# EAGLE design SAML21 Breakout (EAGLE 7.7.0)
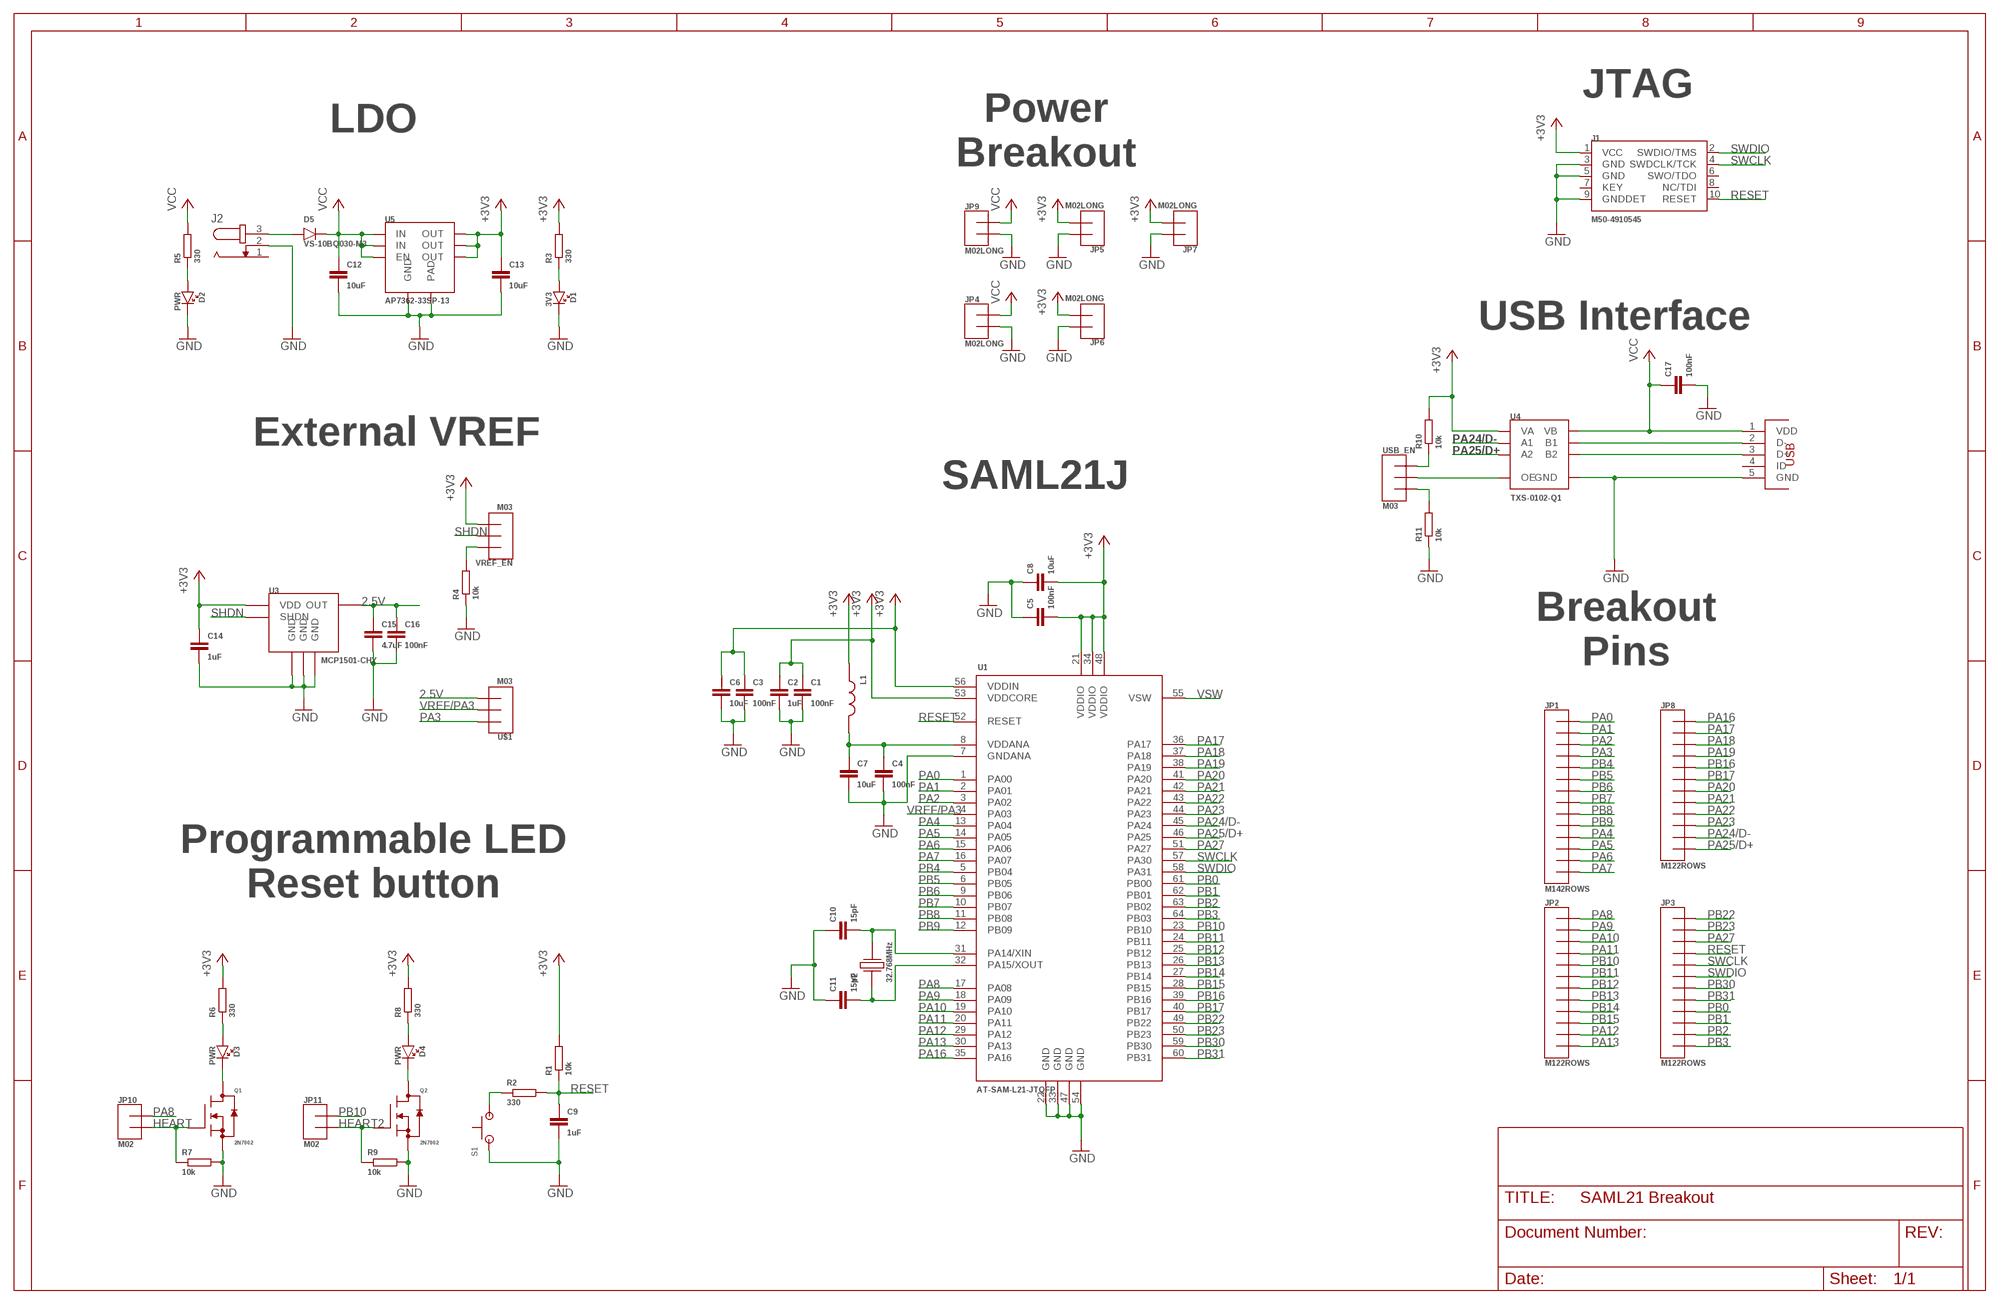
[diagram p0: schematic, sheet 1]

## Parts
C1  100nF  CAP0603  [CAP-0603]
C2  1uF  CAP0603  [CAP-0603]
C3  100nF  CAP0603  [CAP-0603]
C4  100nF  CAP0603  [CAP-0603]
C5  100nF  CAP0603  [CAP-0603]
C6  10uF  CAP0603  [CAP-0603]
C7  10uF  CAP0603  [CAP-0603]
C8  10uF  CAP0603  [CAP-0603]
C9  1uF  CAP0603  [CAP-0603]
C10  15pF  CAP0603  [CAP-0603]
C11  15pF  CAP0603  [CAP-0603]
C12  10uF  CAP0603  [CAP-0603]
C13  10uF  CAP0603  [CAP-0603]
C14  1uF  CAP0603  [CAP-0603]
C15  4.7uF  CAP0603  [CAP-0603]
C16  100nF  CAP0603  [CAP-0603]
C17  100nF  CAP0603  [CAP-0603]
D1  3V3  LED1206  [LED-1206]
D2  PWR  LED1206  [LED-1206]
D3  PWR  LED1206  [LED-1206]
D4  PWR  LED1206  [LED-1206]
D5  VS-10BQ030-M3  [DO-214AA]
J1  M50-4910545  [M50-4910545]
J2  JACK-PLUG0  [SPC4077]
JP1  M142ROWS  [2X07]
JP2  M122ROWS  [2X06]
JP3  M122ROWS  [2X06]
JP4  M02LONG  [1X02-LONG]
JP5  M02LONG  [1X02-LONG]
JP6  M02LONG  [1X02-LONG]
JP7  M02LONG  [1X02-LONG]
JP8  M122ROWS  [2X06]
JP9  M02LONG  [1X02-LONG]
JP10  M02  [1X02]
JP11  M02  [1X02]
L1  INDUCTOR0603  [IND-0603]
Q1  2N7002  [SOT-23-3]
Q2  2N7002  [SOT-23-3]
R1  10k  RESISTOR0805  [RES-0805]
R2  330  RESISTOR0805  [RES-0805]
R3  330  RESISTOR0805  [RES-0805]
R4  10k  RESISTOR0805  [RES-0805]
R5  330  RESISTOR0805  [RES-0805]
R6  330  RESISTOR0805  [RES-0805]
R7  10k  RESISTOR0805  [RES-0805]
R8  330  RESISTOR0805  [RES-0805]
R9  10k  RESISTOR0805  [RES-0805]
R10  10k  RESISTOR0805  [RES-0805]
R11  10k  RESISTOR0805  [RES-0805]
S1  SKHMQME010  [SKHMQME010]
U1  AT-SAM-L21-JTQFP  [TQFP-64]
U3  MCP1501-CHY  [SOT-23-6]
U4  TXS-0102-Q1  [VSSOP-8]
U5  AP7362-33SP-13  [SO-8EP]
U$1  M03  [1X03]
U$6  MOLEX_USBMICRO  [MOLEX_47346-001]
USB_EN  M03  [1X03]
VREF_EN  M03  [1X03]
Y2  32.768MHz  LFXTAL054236-R  [CFPX-217]

## Nets
2.5V: C15.1 C16.1 U3.1(OUT) U$1.3
+3V3: C1.1 C2.1 C3.1 C5.2 C6.1 C8.2 C13.1 C14.1 J1.1(VCC) JP5.2 JP6.2 JP7.2 L1.1 R1.2 R3.2 R6.2 R8.2 R10.2 U1.21(VDDIO) U1.34(VDDIO) U1.48(VDDIO) U1.53(VDDCORE) U1.56(VDDIN) U3.6(VDD) U4.3(VA) U5.5(OUT) U5.6(OUT) U5.7(OUT) VREF_EN.3
GND: C1.2 C2.2 C3.2 C4.2 C5.1 C6.2 C7.2 C8.1 C9.2 C10.1 C11.1 C12.2 C13.2 C14.2 C15.2 C16.2 C17.2 D1.C D2.C J1.3(GND) J1.5(GND) J1.9(GNDDET) J2.2 JP4.2 JP5.1 JP6.1 JP7.1 JP9.2 Q1.S Q2.S R4.1 R7.2 R9.2 R11.1 S1.1 U1.7(GNDANA) U1.22(GND) U1.33(GND) U1.47(GND) U1.54(GND) U3.2(GND) U3.3(GND) U3.5(GND) U4.2(GND) U5.1(GND) U5.PAD U$6.5(GND)
HEART: JP10.2 Q1.D R7.1
HEART2: JP11.2 Q2.D R9.1
N$1: R2.1 S1.3
N$2: D1.A R3.1
N$3: C4.1 C7.1 L1.2 U1.8(VDDANA)
N$4: C10.2 U1.31(PA14/XIN) Y2.2
N$5: C11.2 U1.32(PA15/XOUT) Y2.1
N$6: D2.A R5.1
N$7: R4.2 VREF_EN.1
N$8: D3.A R6.1
N$9: D3.C Q1.G
N$10: D4.A R8.1
N$11: D4.C Q2.G
N$12: D5.A J2.3
N$13: R10.1 USB_EN.1
N$14: U4.8(B1) U$6.2(D-)
N$15: U4.1(B2) U$6.3(D+)
N$17: R11.2 USB_EN.3
N$19: U4.6(OE) USB_EN.2
PA0: JP1.1 U1.1(PA00)
PA1: JP1.2 U1.2(PA01)
PA2: JP1.3 U1.3(PA02)
PA3: JP1.4 U$1.1
PA4: JP1.11 U1.13(PA04)
PA5: JP1.12 U1.14(PA05)
PA6: JP1.13 U1.15(PA06)
PA7: JP1.14 U1.16(PA07)
PA8: JP2.1 JP10.1 U1.17(PA08)
PA9: JP2.2 U1.18(PA09)
PA10: JP2.3 U1.19(PA10)
PA11: JP2.4 U1.20(PA11)
PA12: JP2.11 U1.29(PA12)
PA13: JP2.12 U1.30(PA13)
PA16: JP8.1 U1.35(PA16)
PA17: JP8.2 U1.36(PA17)
PA18: JP8.3 U1.37(PA18)
PA19: JP8.4 U1.38(PA19)
PA20: JP8.7 U1.41(PA20)
PA21: JP8.8 U1.42(PA21)
PA22: JP8.9 U1.43(PA22)
PA23: JP8.10 U1.44(PA23)
PA24/D-: JP8.11 U1.45(PA24) U4.5(A1)
PA25/D+: JP8.12 U1.46(PA25) U4.4(A2)
PA27: JP3.3 U1.51(PA27)
PB0: JP3.9 U1.61(PB00)
PB1: JP3.10 U1.62(PB01)
PB2: JP3.11 U1.63(PB02)
PB3: JP3.12 U1.64(PB03)
PB4: JP1.5 U1.5(PB04)
PB5: JP1.6 U1.6(PB05)
PB6: JP1.7 U1.9(PB06)
PB7: JP1.8 U1.10(PB07)
PB8: JP1.9 U1.11(PB08)
PB9: JP1.10 U1.12(PB09)
PB10: JP2.5 JP11.1 U1.23(PB10)
PB11: JP2.6 U1.24(PB11)
PB12: JP2.7 U1.25(PB12)
PB13: JP2.8 U1.26(PB13)
PB14: JP2.9 U1.27(PB14)
PB15: JP2.10 U1.28(PB15)
PB16: JP8.5 U1.39(PB16)
PB17: JP8.6 U1.40(PB17)
PB22: JP3.1 U1.49(PB22)
PB23: JP3.2 U1.50(PB23)
PB30: JP3.7 U1.59(PB30)
PB31: JP3.8 U1.60(PB31)
RESET: C9.1 J1.10(RESET) JP3.4 R1.1 R2.2 U1.52(RESET)
SHDN: U3.4(SHDN) VREF_EN.2
SWCLK: J1.4(SWDCLK/TCK) JP3.5 U1.57(PA30)
SWDIO: J1.2(SWDIO/TMS) JP3.6 U1.58(PA31)
VCC: C12.1 C17.1 D5.C JP4.1 JP9.1 R5.2 U4.7(VB) U5.2(EN) U5.3(IN) U5.4(IN) U$6.1(VDD)
VREF/PA3: U1.4(PA03) U$1.2
VSW: U1.55(VSW)
Unconnected: J1.6(SWO/TDO) J1.7(KEY) J1.8(NC/TDI) J2.1 S1.5 U5.8(NC) U$6.4(ID)

## Notes on the sheet
- JTAG
- LDO
- Power
  Breakout
- USB Interface
- External VREF
- SAML21J
- Breakout
  Pins
- Programmable LED
  Reset button

## Library data of the parts
C1-C17 = dr-library:CAP: Multilayer Ceramic Capacitor
D1-D4 = dr-library:LED
D5 = dr-library:VS-10BQ030-M3: Vishay Semiconductors High Performance Schottky Rectifier 1.0A Mfg. No. VS-10BQ030-M3/5BT http://www.mouser.com/ds/2/427/vs-10bq030-m3-552919.pdf
J1 = dr-library:M50-4910545: Harwin 10-pin Connector M50 Series 1.27mm pitch
J2 = EmbeddedAdventures 3:JACK-PLUG: DC POWER JACK Power Jack, DC, Right Angle, Through Hole, Rated 5A at 16VDC, PC Terminals Distributor: Farnell (www.Farnell.de) Drawing: 84N1161.pdf / 84N1162.pdf Manufacturer: SPC Technology (www.spctechnology.com) Type: SPC4077 / SPC 4078
JP1 = dr-library:M14
JP2 JP3 JP8 = dr-library:M12
JP4-JP7 JP9-JP11 = dr-library:M02
L1 = dr-library:INDUCTOR
Q1 Q2 = dr-library:2N7002: Fairchild ON Semiconductor n-Type Field Effect Transistor Mfg. No. 2N7002 Mouser No. 512-2N7002 http://www.mouser.com/ds/2/149/2N7002-1006482.pdf
R1-R11 = dr-library:RESISTOR
S1 = dr-library:SKHMQME010: ALPS Tactile Switch 50mA at 12V Mouser Product # 688-SKHMQME010
U1 = dr-library:AT-SAM-L21-J: Atmel/Microchip SAML21 Series, 64-pin 32-bit ARM Cortex M0+
U3 = dr-library:MCP1501: High Precision Buffered Voltage Reference Mfg. No. MCP1501T-25E/CHY Series Reference
U4 = dr-library:TXS-0102-Q1: Texas Instruments 2-bit Bi-Directional Voltage-Level Translator Open-drain and push-pull application
U5 = dr-library:AP7362-33SP-13: Diodes Inc. Ultra Low Dropout Linear Regulator AP7362C-33SP-13 Fixed output 3.3V
U$1 USB_EN VREF_EN = dr-library:M03
U$6 = dr-library:MOLEX_USBMICRO
Y2 = dr-library:LFXTAL054236-R: Crystal 32.768MHz IQD Frequency Products Manufacturer Part # LFXTAL054236Reel

## Board
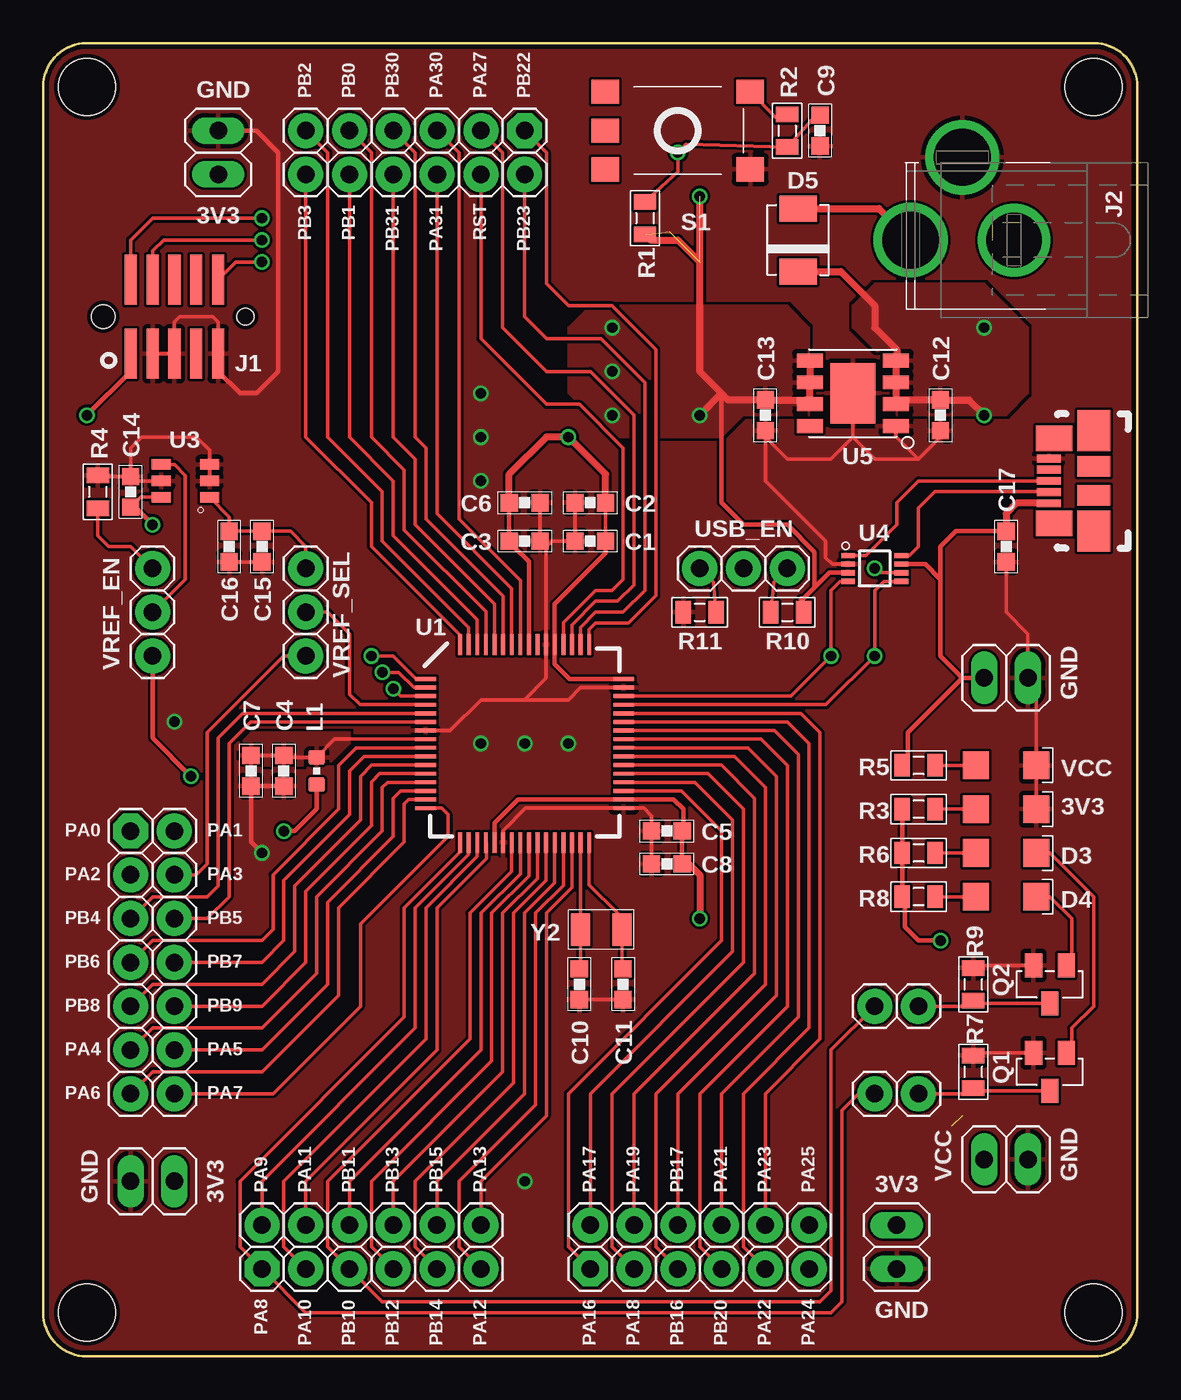
[diagram p1: board, top side]
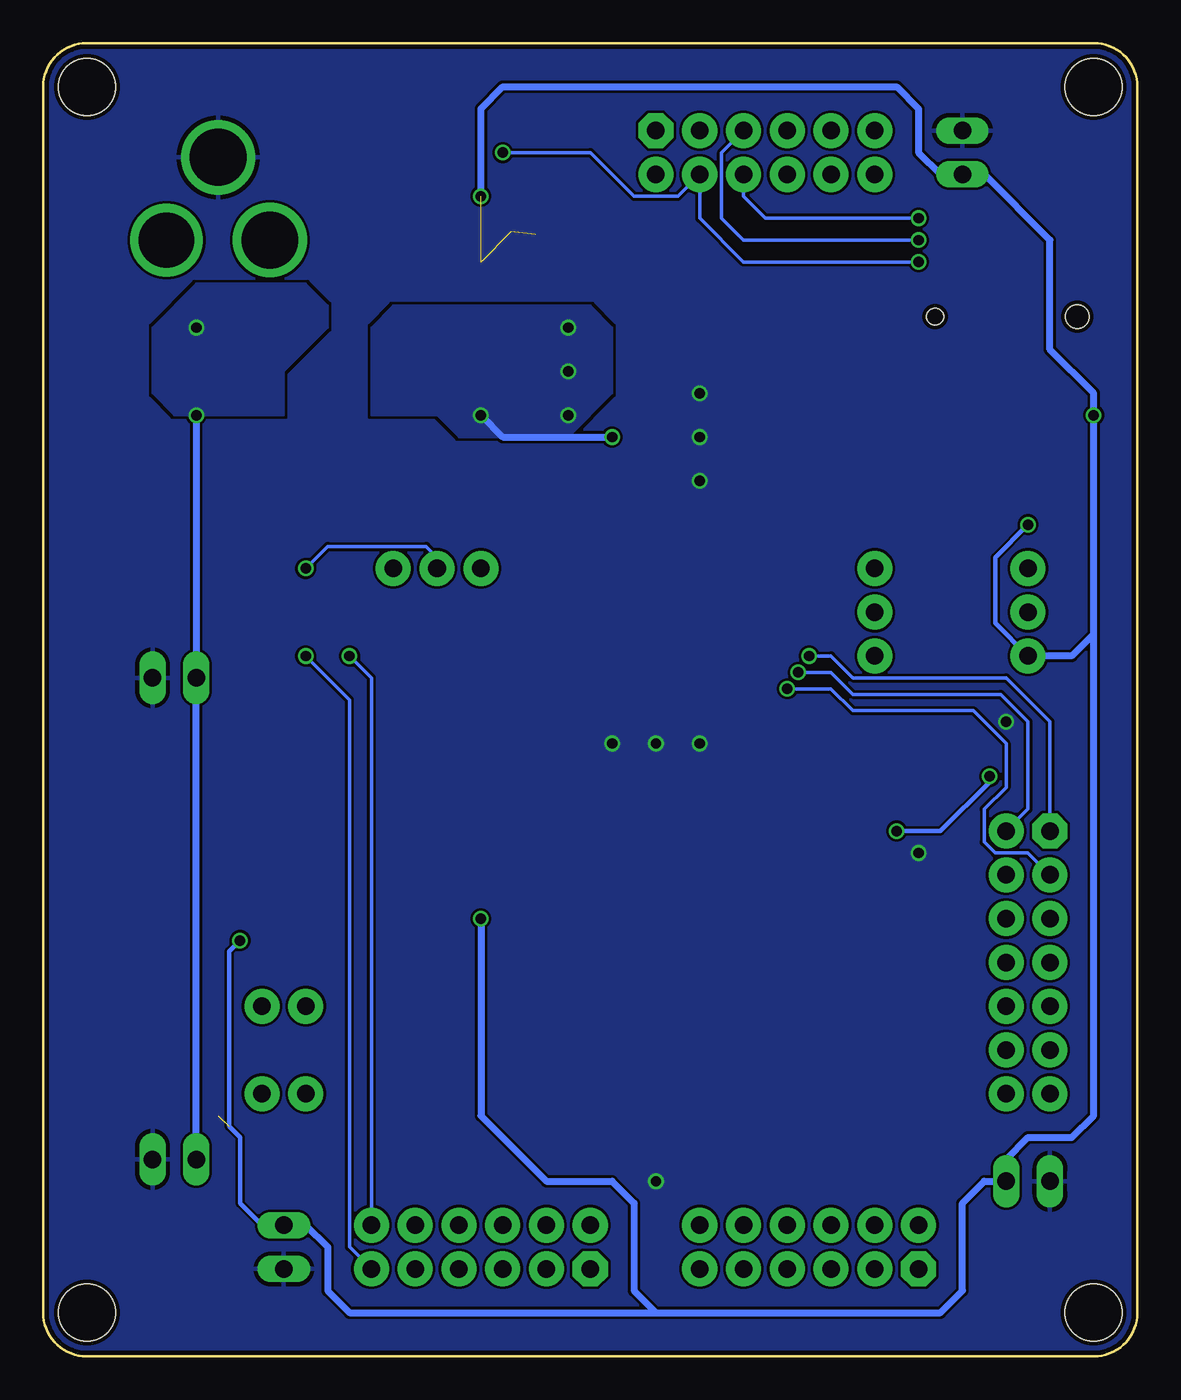
[diagram p2: board, bottom side, seen from below]

Size 63.5 x 76.2 mm. Coordinates in mm from the lower left corner, seen from the top.
Outline: 2.54,76.2 arc90 0,73.66 0,2.54 arc90 2.54,0 60.96,0 arc90 63.5,2.54 63.5,73.66 arc90 60.96,76.2 2.54,76.2
Copper layers (1*16): Top 0.035mm / dielectric 1.5mm / Bottom 0.035mm
Design rules "SeeedStudio_2layer_DRU_no_angle_20140221": minimum track width 6mil, minimum drill 12mil, track to track 6mil, track to pad 6mil, pad to pad 6mil, via to via 6mil, smd to smd 0mil, copper to edge 10mil, drill to drill 10mil, minimum pad ring 10mil, minimum via ring 6mil, stop-mask expansion 2mil, vias tented up to drill 100mil, thermal gap 10mil

### Footprints (pad centres in the part's own frame; a part is rotated, then mirrored left to right if it is on the bottom)
CAP-0603 = smd 1 x 1: 1 -0.889,0; 2 0.889,0
LED-1206 = smd 1.5 x 1.6: A -1.75,0; C 1.75,0
DO-214AA = smd 1.52 x 2.18: A 1.83,0; C -1.83,0
M50-4910545 = smd 0.7 x 2.9: 1 -2.54,-2.15; 2 -2.54,2.15; 3 -1.25,-2.15; 4 -1.25,2.15; 5 0,-2.15; 6 0,2.15; 7 1.27,-2.15; 8 1.27,2.15; 9 2.54,-2.15; 10 2.54,2.15 | hole 0.95: 4.12,0 | hole 1.35: -4.12,0
SPC4077 = drill 3.2: 1 -3,0 | drill 3.3: 2 0,-4.8; 3 3,0
2X07 = drill 1.016 pad 2.032 octagon: 1 -6.35,-1.27 | drill 1.016 pad 2.032: 2 -6.35,1.27; 3 -3.81,-1.27; 4 -3.81,1.27; 5 -1.27,-1.27; 6 -1.27,1.27; 7 1.27,-1.27; 8 1.27,1.27; 9 3.81,-1.27; 10 3.81,1.27; 11 6.35,-1.27; 12 6.35,1.27; 13 8.89,-1.27; 14 8.89,1.27
2X06 = drill 1.016 pad 2.032 octagon: 1 -1.27,-2.54 | drill 1.016 pad 2.032: 2 -1.27,0; 3 1.27,-2.54; 4 1.27,0; 5 3.81,-2.54; 6 3.81,0; 7 6.35,-2.54; 8 6.35,0; 9 8.89,-2.54; 10 8.89,0; 11 11.43,-2.54; 12 11.43,0
1X02-LONG = drill 1.016 long: 1 -1.27,0; 2 1.27,0
1X02 = drill 1.016 pad 2.032: 1 -1.27,0; 2 1.27,0
IND-0603 = smd 0.8 x 0.96: 1 -0.79,0; 2 0.79,0
SOT-23-3 = smd 1 x 1.4: D 0,1.1; G -0.95,-1.1; S 0.95,-1.1
RES-0805 = smd 0.9 x 1.3: 1 -0.95,0; 2 0.95,0
SKHMQME010 = smd 1.6 x 1.4: 1 -4.2,2.25; 2 4.2,2.25; 3 -4.2,-2.25; 4 4.2,-2.25; 5 4.2,0
TQFP-64 = smd 1.2 x 0.22: 1 -5.75,3.75; 2 -5.75,3.25; 3 -5.75,2.75; 4 -5.75,2.25; 5 -5.75,1.75; 6 -5.75,1.25; 7 -5.75,0.75; 8 -5.75,0.25; 9 -5.75,-0.25; 10 -5.75,-0.75; 11 -5.75,-1.25; 12 -5.75,-1.75; 13 -5.75,-2.25; 14 -5.75,-2.75; 15 -5.75,-3.25; 16 -5.75,-3.75; 33 5.75,-3.75; 34 5.75,-3.25; 35 5.75,-2.75; 36 5.75,-2.25; 37 5.75,-1.75; 38 5.75,-1.25; 39 5.75,-0.75; 40 5.75,-0.25; 41 5.75,0.25; 42 5.75,0.75; 43 5.75,1.25; 44 5.75,1.75; 45 5.75,2.25; 46 5.75,2.75; 47 5.75,3.25; 48 5.75,3.75 | smd 0.22 x 1.2: 17 -3.75,-5.75; 18 -3.25,-5.75; 19 -2.75,-5.75; 20 -2.25,-5.75; 21 -1.75,-5.75; 22 -1.25,-5.75; 23 -0.75,-5.75; 24 -0.25,-5.75; 25 0.25,-5.75; 26 0.75,-5.75; 27 1.25,-5.75; 28 1.75,-5.75; 29 2.25,-5.75; 30 2.75,-5.75; 31 3.25,-5.75; 32 3.75,-5.75; 49 3.75,5.75; 50 3.25,5.75; 51 2.75,5.75; 52 2.25,5.75; 53 1.75,5.75; 54 1.25,5.75; 55 0.75,5.75; 56 0.25,5.75; 57 -0.25,5.75; 58 -0.75,5.75; 59 -1.25,5.75; 60 -1.75,5.75; 61 -2.25,5.75; 62 -2.75,5.75; 63 -3.25,5.75; 64 -3.75,5.75
SOT-23-6 = smd 0.6 x 1.1: 1 -0.95,-1.4; 2 0,-1.4; 3 0.95,-1.4; 4 0.95,1.4; 5 0,1.4; 6 -0.95,1.4
VSSOP-8 = smd 0.3 x 0.8: 1 -0.75,-1.55; 2 -0.25,-1.55; 3 0.25,-1.55; 4 0.75,-1.55; 5 0.75,1.55; 6 0.25,1.55; 7 -0.25,1.55; 8 -0.75,1.55
SO-8EP = smd 0.802 x 1.505: 1 -1.905,-2.498; 2 -0.635,-2.498; 3 0.635,-2.498; 4 1.905,-2.498; 5 1.905,2.498; 6 0.635,2.498; 7 -0.635,2.498; 8 -1.905,2.498 | smd 3.502 x 2.613: PAD 0,0
1X03 = drill 1.016 pad 2.032: 1 -1.27,0; 2 1.27,0; 3 3.81,0
STAND-OFF-HOLE = hole 3.3: 0,0
MOLEX_47346-001 = smd 1.38 x 0.45: 1 2.61,1.3; 2 2.61,0.65; 3 2.61,0; 4 2.61,-0.65; 5 2.61,-1.3 | smd 2.1 x 1.475: P$1 2.3,2.462; P$2 2.3,-2.462 | smd 1.9 x 1.175: P$3 0,0.838; P$4 0,-0.838 | smd 1.9 x 2.375: P$5 0,2.913; P$6 0,-2.913
CFPX-217 = smd 1.1 x 1.9: 1 -1.2,0; 2 1.2,0

### Placement (x,y rotation side)
C1  31.75,47.31 180 top
C2  31.75,49.53 180 top
C3  27.94,47.31 0 top
C4  13.97,33.97 270 top
C5  36.2,30.48 0 top
C6  27.94,49.53 0 top
C7  12.06,33.97 270 top
C8  36.2,28.57 0 top
C9  45.09,71.12 270 top
C10  31.11,21.59 90 top
C11  33.66,21.59 90 top
C12  52.07,54.61 270 top
C13  41.91,54.61 270 top
C14  5.08,50.16 90 top
C15  12.7,46.99 270 top
C16  10.79,46.99 270 top
C17  55.88,46.99 270 top
D1  55.88,31.75 0 top
D2  55.88,34.29 0 top
D3  55.88,29.21 0 top
D4  55.88,26.67 0 top
D5  43.81,64.77 90 top
J1  7.62,60.33 0 top
J2  53.34,64.77 180 top
JP1  6.35,24.13 270 top
JP2  13.97,7.62 0 top
JP3  26.67,68.58 180 top
JP4  55.88,11.43 0 top
JP5  49.53,6.35 90 top
JP6  6.35,10.16 0 top
JP7  10.16,69.85 270 top
JP8  33.02,7.62 0 top
JP9  55.88,39.37 0 top
JP10  49.53,15.24 0 top
JP11  49.53,20.32 0 top
L1  15.88,33.97 90 top
Q1  58.42,16.51 180 top
Q2  58.42,21.59 180 top
R1  34.92,66.04 270 top
R2  43.18,71.12 270 top
R3  50.8,31.75 180 top
R4  3.17,50.16 270 top
R5  50.8,34.29 180 top
R6  50.8,29.21 180 top
R7  53.98,16.51 90 top
R8  50.8,26.67 180 top
R9  53.98,21.59 90 top
R10  43.18,43.18 0 top
R11  38.1,43.18 0 top
S1  36.83,71.12 180 top
U1  27.94,35.56 0 top
U3  8.26,50.8 90 top
U4  48.26,45.72 270 top
U5  46.99,55.88 90 top
U$1  15.24,41.91 90 top
U$2  [STAND-OFF-HOLE]  2.54,2.54 0 top
U$3  [STAND-OFF-HOLE]  2.54,73.66 0 top
U$4  [STAND-OFF-HOLE]  60.96,73.66 0 top
U$5  [STAND-OFF-HOLE]  60.96,2.54 0 top
U$6  60.96,50.8 180 top
USB_EN  41.91,45.72 180 top
VREF_EN  6.35,44.45 270 top
Y2  32.38,24.77 180 top

### Tracks (layer width: path | path; a pad name or v marks a point on that pad's centre or on a via)
2.5V
  Top 0.203: U3.1 10.79,48.71 C16.1 C15.1 14.35,47.88 15.24,46.99 U$1.3
+3V3  (via drill 0.6)  (4 unrouted)
  Top 0.203: U3.6 5.65,49.85 C14.1 | C2.1 C1.1 | 27.3,46.99 27.3,47.05 | 37.15,30.54 C5.2
  Top 0.254: U1.21 26.19,30.95 27.55,32.31 U1.34 36.59,32.31 37.15,31.75 37.15,30.54 | C1.1 32.64,46.61 29.69,43.66 U1.53 29.69,40.16 30.54,39.31 U1.48 | U1.56 28.19,46.1 27.3,46.99 | 27.3,47.05 C3.1 C6.1 | R3.2 R6.2 R8.2 50.01,26.67 50.01,24.92 50.8,24.13 v52.07,24.13 | VREF_EN.3 6.35,35.88 v8.57,33.66 | v13.97,30.48 14.61,30.48 15.88,31.75 L1.1 | 39.37,55.88 39.37,49.53 40.64,48.26 43.18,48.26 44.77,46.67 44.77,44.62 | R10.2 43.97,43.81 | 43.97,43.81 43.97,43.97 | C5.2 C8.2 | C14.1 5.33,49.28 v6.35,48.26 | 44.77,44.62 43.97,43.81 | U4.3 45.62,45.47 44.77,44.62 | J1.1 5.08,57.15 v2.54,54.61
  Top 0.406: C6.1 27.05,51.18 29.21,53.34 v30.48,53.34 32.64,51.18 C2.1 | 39.37,55.88 38.1,57.15 38.1,63.5 | 38.1,63.5 v38.1,67.31 | v38.1,54.61 39.37,55.88 | C8.2 37.47,28.57 38.1,27.94 v38.1,25.4 | U5.5 U5.6 U5.7 44.24,55.5 C13.1 39.75,55.5 39.37,55.88 | 35.24,64.77 36.83,64.77 38.1,63.5
  Bottom 0.254: v8.57,33.66 8.57,33.34 11.43,30.48 v13.97,30.48 | JP5.2 50.8,7.62 52.07,8.89 52.07,12.7 52.7,13.34 52.7,23.5 v52.07,24.13 | v6.35,48.26 8.26,46.35 8.26,42.55 VREF_EN.3
  Bottom 0.406: v38.1,54.61 36.83,53.34 v30.48,53.34 | v38.1,67.31 38.1,72.39 36.83,73.66 13.97,73.66 12.7,72.39 12.7,69.85 11.43,68.58 JP7.2 8.89,68.58 5.08,64.77 5.08,58.42 2.54,55.88 v2.54,54.61 2.54,41.91 | VREF_EN.3 3.81,40.64 2.54,41.91 | 2.54,41.91 2.54,13.97 3.81,12.7 6.35,12.7 7.62,11.43 JP6.2 8.89,10.16 10.16,8.89 10.16,3.81 11.43,2.54 27.94,2.54 | JP5.2 48.26,7.62 46.99,6.35 46.99,3.81 45.72,2.54 27.94,2.54 | v38.1,25.4 38.1,13.97 34.29,10.16 30.48,10.16 29.21,8.89 29.21,3.81 27.94,2.54
  other vias: 33.02,54.61 33.02,57.15 33.02,59.69
  pour Top: 44.45,54.61 40.64,54.61 39.37,53.34 33.02,53.34 30.48,55.88 30.48,59.69 31.75,60.96 43.18,60.96 44.45,59.69
  pour Bottom: 44.45,59.69 43.18,60.96 31.75,60.96 30.48,59.69 30.48,55.88 33.02,53.34 39.37,53.34 40.64,54.61 44.45,54.61
GND  (via drill 0.6)
  Top 0.203: C16.2 C15.2 | C11.1 C10.1 | U1.22 26.69,30.5 28,31.81 U1.33 34.87,31.81 35.31,31.37 C5.1 C8.1 | C6.2 C3.2 29.19,46.95 | C2.2 C1.2 29.55,47.31 29.19,46.95 | 29.19,46.95 U1.54 29.19,39.35 27.94,38.1 | U3.5 5.33,50.8 C14.2 | C14.2 3.28,51.05 R4.1 | U3.2 U3.3 9.65,52.58 8.89,53.34 5.71,53.34 5.08,52.7 C14.2 | U1.47 31.19,38.81 30.48,38.1 27.94,38.1 | J1.3 J1.5 7.62,60.01 7.94,60.33 9.84,60.33 10.16,60.01 J1.9 | Q2.S 54.29,22.69 R9.2 | Q1.S 54.29,17.61 R7.2 | D1.C D2.C 57.63,38.89 JP9.2 57.15,41.91 55.88,43.18 C17.2 | U1.7 23.61,36.31 25.4,38.1 27.94,38.1 | U4.2 45.79,45.97 45.4,46.35 45.4,47.31 41.91,50.8 41.91,53.34 | 41.91,53.34 43.18,52.07 45.72,52.07 46.99,53.34 | U5.PAD 46.99,53.34 | 46.99,53.34 48.26,52.07 50.8,52.07 | 50.8,52.07 52.07,53.34 C12.2 | U5.1 49.49,53.38 50.8,52.07 | 41.91,53.34 C13.2
  Top 0.254: JP7.1 12.38,71.12 13.65,69.85 13.65,57.15 12.38,55.88 11.43,55.88 10.16,57.15 J1.9 | v12.7,29.21 12.06,29.84 C7.2 C4.2
  other vias: 7.62,36.83 27.94,10.16 25.4,53.34 25.4,55.88 25.4,50.8 27.94,35.56 30.48,35.56 25.4,35.56
  pour Top (rank 2): -2.54,78.74 -2.54,-2.54 66.04,-2.54 66.04,78.74
  pour Bottom (rank 2): -2.54,78.74 -2.54,-2.54 66.04,-2.54 66.04,78.74
HEART
  Top 0.203: JP10.2 53.49,15.24 R7.1 54.29,15.41 Q1.D
HEART2
  Top 0.203: JP11.2 53.49,20.32 R9.1 54.29,20.49 Q2.D
N$1
  Top 0.203: R2.1 42.49,71.91 S1.3
N$2
  Top 0.203: R3.1 D1.A
N$3
  Top 0.203: U1.8 16.92,35.81 L1.2 14.07,34.76 C4.1 C7.1
  pour Top: 11.43,35.56 11.43,34.29 16.51,34.29 17.78,35.56 17.78,36.2 12.06,36.2
N$4
  Top 0.203: C10.2 31.18,22.55 Y2.2 U1.31
N$5
  Top 0.203: C11.2 33.59,22.55 Y2.1 33.34,25.01 33.34,25.72 31.69,27.36 U1.32
N$6
  Top 0.203: R5.1 D2.A
N$7
  Top 0.203: R4.2 3.17,47.62 3.81,46.99 5.08,46.99 VREF_EN.1
N$8
  Top 0.203: R6.1 D3.A
N$9
  Top 0.203: D3.C 58.42,29.21 60.96,26.67 60.96,20.32 59.69,19.05 59.69,17.93 Q1.G
N$10
  Top 0.203: R8.1 D4.A
N$11
  Top 0.203: D4.C 58.42,26.67 59.69,25.4 59.69,23.01 Q2.G
N$12
  Top 0.406: D5.A 48.51,66.6 J2.3
N$13
  Top 0.203: R10.1 42.39,44.93 USB_EN.1
N$14
  Top 0.203: U4.8 50.28,46.47 50.8,46.99 50.8,49.21 51.75,50.16 58.34,50.16 U$6.2
N$15
  Top 0.203: U4.1 47.74,46.47 49.53,48.26 49.53,49.53 50.8,50.8 U$6.3
N$17
  Top 0.203: R11.2 38.89,44.93 USB_EN.3
N$19  (via drill 0.6)
  Top 0.203: U4.6 48.51,45.47 v48.26,45.72
  Bottom 0.203: v48.26,45.72 46.99,46.99 41.27,46.99 40.64,46.35 USB_EN.2
PA0  (via drill 0.6)
  Top 0.203: U1.1 21.65,39.31 20.32,40.64 v19.05,40.64
  Bottom 0.203: v19.05,40.64 17.78,40.64 16.51,39.37 7.62,39.37 5.08,36.83 JP1.1
PA1  (via drill 0.6)
  Top 0.203: U1.2 21.52,38.81 20.64,39.69 v19.68,39.69
  Bottom 0.203: v19.68,39.69 17.78,39.69 16.51,38.42 7.94,38.42 6.35,36.83 6.35,31.75 JP1.2
PA2  (via drill 0.6)
  Top 0.203: U1.3 20.75,38.31 v20.32,38.73
  Bottom 0.203: v20.32,38.73 17.78,38.73 16.51,37.47 9.53,37.47 7.62,35.56 7.62,33.02 8.89,31.75 8.89,29.84 8.26,29.21 6.35,29.21 JP1.3
PA3
  Top 0.203: U$1.1 13.97,40.64 9.53,36.2 9.53,28.57 8.89,27.94 JP1.4
PA4
  Top 0.203: JP1.11 6.35,19.05 12.7,19.05 15.88,22.23 15.88,26.67 19.68,30.48 19.68,33.02 19.98,33.31 U1.13
PA5
  Top 0.203: U1.14 20.75,32.81 20.32,32.38 20.32,30.16 16.51,26.35 16.51,21.59 12.7,17.78 JP1.12
PA6
  Top 0.203: JP1.13 6.35,16.51 12.7,16.51 17.14,20.95 17.14,26.04 20.95,29.84 20.95,32.07 21.2,32.31 U1.15
PA7
  Top 0.203: JP1.14 13.34,15.24 18.41,20.32 18.41,25.08 23.5,30.16 23.5,31.43 23.12,31.81 U1.16
PA8
  Top 0.203: U1.17 24.19,29.27 20.95,26.04 20.95,19.68 11.43,10.16 11.43,6.35 JP2.1 15.24,2.54 45.72,2.54 46.35,3.17 46.35,14.29 47.31,15.24 JP10.1
PA9
  Top 0.203: U1.18 24.69,29.14 21.59,26.04 21.59,19.05 12.7,10.16 JP2.2
PA10
  Top 0.203: U1.19 25.19,29 22.23,26.04 22.23,18.41 13.97,10.16 13.97,6.35 JP2.3
PA11
  Top 0.203: JP2.4 15.24,10.16 22.86,17.78 22.86,26.04 25.72,28.89 25.72,29.78 U1.20
PA12
  Top 0.203: JP2.11 24.13,6.35 24.13,10.16 28.57,14.61 28.57,25.72 30.19,27.33 U1.29
PA13
  Top 0.203: U1.30 30.69,27.2 29.21,25.72 29.21,13.97 25.4,10.16 JP2.12
PA16
  Top 0.203: JP8.1 30.48,6.35 30.48,15.24 39.37,24.13 39.37,30.48 37.04,32.81 U1.35
PA17
  Top 0.203: U1.36 37.81,33.31 40.01,31.11 40.01,23.5 31.75,15.24 JP8.2
PA18
  Top 0.203: JP8.3 33.02,6.35 33.02,15.24 40.64,22.86 40.64,31.75 38.58,33.81 U1.37
PA19
  Top 0.203: U1.38 39.35,34.31 41.27,32.38 41.27,22.23 34.29,15.24 JP8.4
PA20
  Top 0.203: JP8.7 38.1,6.35 38.1,15.24 43.18,20.32 43.18,34.29 41.66,35.81 U1.41
PA21
  Top 0.203: U1.42 42.43,36.31 43.81,34.92 43.81,19.68 39.37,15.24 JP8.8
PA22
  Top 0.203: JP8.9 40.64,6.35 40.64,15.24 44.45,19.05 44.45,35.56 43.2,36.81 U1.43
PA23
  Top 0.203: U1.44 43.97,37.31 45.09,36.2 45.09,18.41 41.91,15.24 JP8.10
PA24/D-  (via drill 0.6)
  Top 0.203: U1.45 45.43,37.81 v48.26,40.64 48.26,44.45 48.78,44.97 U4.5
  Bottom 0.203: JP8.11 45.72,6.35 45.72,38.1 v48.26,40.64
PA25/D+  (via drill 0.6)
  Top 0.203: U1.46 43.39,38.31 v45.72,40.64 45.72,44.45 46.24,44.97 U4.4
  Bottom 0.203: JP8.12 44.45,39.37 v45.72,40.64
PA27
  Top 0.203: U1.51 30.69,42.44 32.07,43.81 33.34,43.81 34.29,44.77 34.29,54.61 31.75,57.15 29.21,57.15 26.67,59.69 26.67,69.85 JP3.3
PB0
  Top 0.203: U1.61 25.69,43.21 20.95,47.94 20.95,51.44 19.05,53.34 19.05,69.85 JP3.9
PB1
  Top 0.203: U1.62 25.19,42.76 20.32,47.62 20.32,50.8 17.78,53.34 JP3.10
PB2
  Top 0.203: U1.63 24.69,42.3 19.68,47.31 19.68,50.16 16.51,53.34 16.51,69.85 JP3.11
PB3
  Top 0.203: U1.64 24.19,41.85 19.05,46.99 19.05,49.53 15.24,53.34 JP3.12
PB4
  Top 0.203: JP1.5 6.35,26.67 9.53,26.67 10.16,27.3 10.16,35.88 11.59,37.31 U1.5
PB5
  Top 0.203: U1.6 12.04,36.81 10.79,35.56 10.79,26.67 9.53,25.4 JP1.6
PB6
  Top 0.203: JP1.7 6.35,24.13 12.7,24.13 13.34,24.77 13.34,27.94 17.14,31.75 17.14,34.29 18.16,35.31 U1.9
PB7
  Top 0.203: JP1.8 12.7,22.86 13.97,24.13 13.97,27.62 17.78,31.43 17.78,33.97 18.62,34.81 U1.10
PB8
  Top 0.203: JP1.9 6.35,21.59 12.7,21.59 14.61,23.5 14.61,27.3 18.41,31.11 18.41,33.66 19.07,34.31 U1.11
PB9
  Top 0.203: U1.12 19.52,33.81 19.05,33.34 19.05,30.8 15.24,26.99 15.24,22.86 12.7,20.32 JP1.10
PB10
  Top 0.203: U1.23 27.19,28.14 24.77,25.72 24.77,18.41 16.51,10.16 16.51,6.35 JP2.5 19.68,3.17 45.09,3.17 45.72,3.81 45.72,17.78 JP11.1
PB11
  Top 0.203: JP2.6 17.78,10.16 25.4,17.78 25.4,25.72 27.69,28.01 U1.24
PB12
  Top 0.203: JP2.7 19.05,6.35 19.05,10.16 26.04,17.14 26.04,25.72 28.19,27.87 U1.25
PB13
  Top 0.203: JP2.8 20.32,10.16 26.67,16.51 26.67,25.72 28.69,27.74 U1.26
PB14
  Top 0.203: JP2.9 21.59,6.35 21.59,10.16 27.3,15.88 27.3,25.72 29.19,27.6 U1.27
PB15
  Top 0.203: JP2.10 22.86,10.16 27.94,15.24 27.94,25.72 29.69,27.47 U1.28
PB16
  Top 0.203: JP8.5 35.56,6.35 35.56,15.24 41.91,21.59 41.91,33.02 40.12,34.81 U1.39
PB17
  Top 0.203: U1.40 40.89,35.31 42.55,33.66 42.55,20.95 36.83,15.24 JP8.6
PB22
  Top 0.203: U1.49 31.69,42.17 32.07,42.55 33.97,42.55 35.56,44.13 35.56,58.42 33.02,60.96 30.48,60.96 29.21,62.23 29.21,69.85 JP3.1
PB23
  Top 0.203: U1.50 31.19,42.3 32.07,43.18 33.66,43.18 34.92,44.45 34.92,56.52 32.38,59.05 29.21,59.05 27.94,60.33 JP3.2
PB30
  Top 0.203: U1.59 26.69,44.11 22.23,48.58 22.23,52.7 21.59,53.34 21.59,69.85 JP3.7
PB31
  Top 0.203: U1.60 26.19,43.66 21.59,48.26 21.59,52.07 20.32,53.34 JP3.8
RESET  (via drill 0.6)
  Top 0.203: U1.52 30.19,42.57 32.07,44.45 33.02,44.45 33.66,45.09 33.66,52.7 31.11,55.24 29.21,55.24 25.4,59.05 JP3.4 | C9.1 44.86,72.01 R2.2 37.31,70.33 v36.83,69.85 36.83,68.73 R1.1 | 10.16,63.5 J1.10 11.19,63.5 v12.7,63.5
  Bottom 0.203: v36.83,69.85 31.75,69.85 29.21,67.31 26.67,67.31 JP3.4 25.4,66.04 22.86,63.5 v12.7,63.5
SHDN
  Top 0.203: U3.4 7.62,51.75 8.26,51.12 8.26,45.09 VREF_EN.2
SWCLK  (via drill 0.6)
  Top 0.203: U1.57 27.69,45.02 24.13,48.58 24.13,69.85 JP3.5 | J1.4 6.37,64.16 6.99,64.77 v12.7,64.77
  Bottom 0.203: v12.7,64.77 22.86,64.77 24.13,66.04 24.13,69.85 JP3.5
SWDIO  (via drill 0.6)
  Top 0.203: U1.58 27.19,44.56 22.86,48.9 JP3.6 | J1.2 5.08,64.77 6.35,66.04 v12.7,66.04
  Bottom 0.203: v12.7,66.04 21.59,66.04 22.86,67.31 JP3.6
VCC  (via drill 0.6)
  Top 0.254: U4.7 51.19,45.97 52.07,45.09 | C17.1 52.96,47.88 52.07,46.99 52.07,45.09 | 52.07,45.09 52.07,40.64 53.34,39.37 | 53.34,39.37 JP9.1 | 53.34,39.37 50.16,36.2 50.16,34.44 R5.2
  Top 0.406: U$6.1 56.48,49.5 55.88,48.9 C17.1 | v54.61,54.61 53.72,55.5 C12.1 49.74,55.5 U5.2 U5.3 U5.4 49.53,57.83 49.53,58.42 48.26,59.69 48.26,60.96 46.28,62.94 D5.C
  Bottom 0.406: JP4.1 JP9.1 v54.61,54.61
  other vias: 54.61,59.69
  pour Top: 46.99,60.96 48.26,62.23 54.61,62.23 55.88,60.96 57.15,59.69 57.15,55.88 55.88,54.61 49.53,54.61 49.53,57.15 48.26,58.42 46.99,59.69
  pour Bottom: 48.26,62.23 46.99,60.96 46.99,59.69 49.53,57.15 49.53,54.61 55.88,54.61 57.15,55.88 57.15,59.69 54.61,62.23
VREF/PA3
  Top 0.203: U1.4 18.39,37.81 17.78,38.42 17.78,41.91 16.51,43.18 U$1.2

### Text on the board
tPlace: GND | PB2 | PB0 | PB30 | PA30 | PA27 | PB22 | 3V3 | PB3 | PB1 | RST | PB31 | PA31 | PB23 | VREF_SEL | GND | VCC | PA0 | PA1 | PA2 | PA3 | PB4 | PB5 | PB6 | PB7 | PB8 | PB9 | PA4 | PA5 | PA6 | PA7 | PA9 | PA11 | PB11 | PB13 | PB15 | PA13 | PA17 | PA19 | PB17 | PA21 | PA23 | PA25 | 3V3 | VCC | GND | GND | 3V3 | GND | PA8 | PA10 | PB10 | PB12 | PB14 | PA12 | PA16 | PA18 | PB16 | PB20 | PA22 | PA24